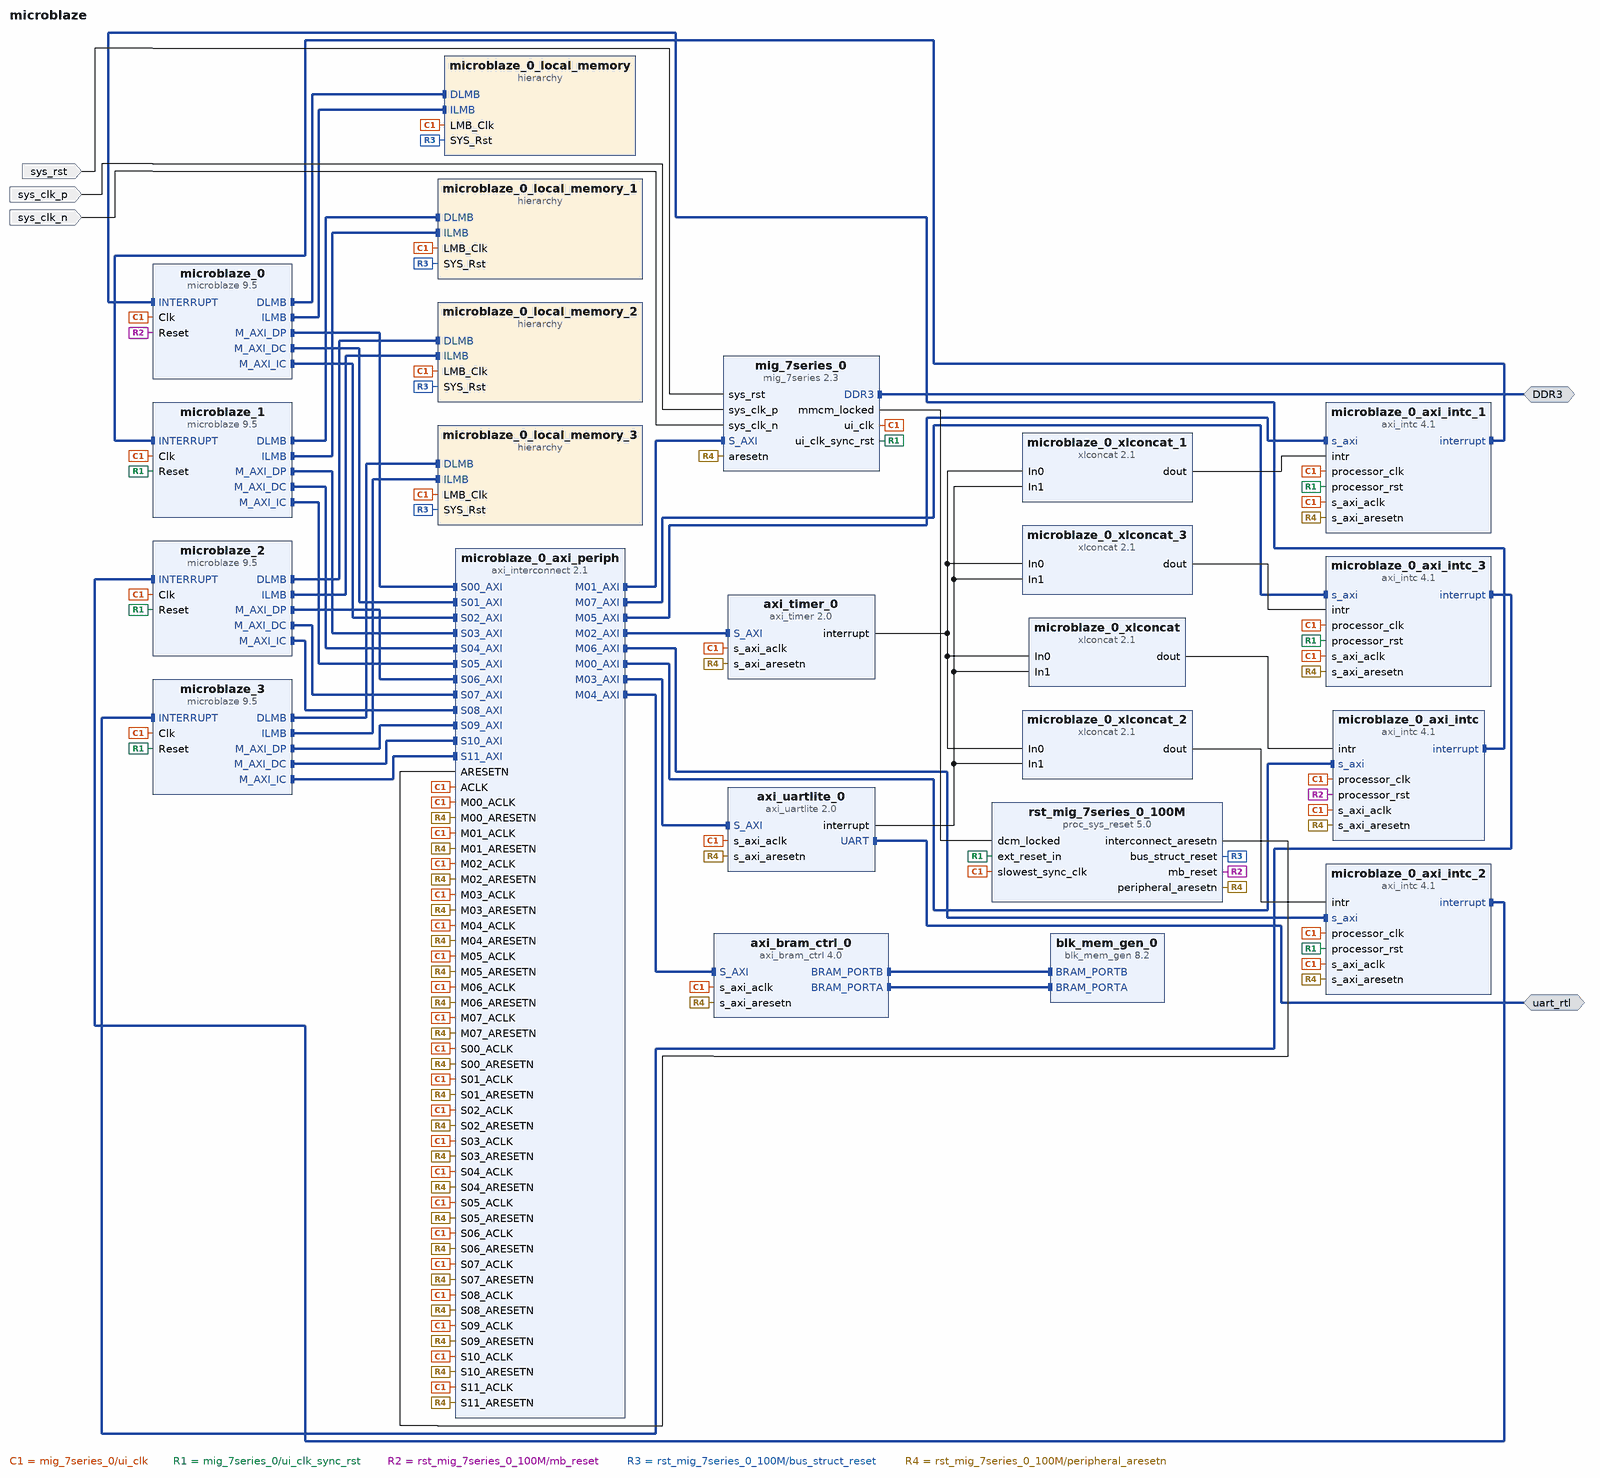
[diagram p0: block diagram of the top level]
# Vivado block design microblaze, Vivado 2015.1
create_bd_design microblaze

create_bd_intf_port -mode Master -vlnv xilinx.com:interface:uart_rtl:1.0 uart_rtl
create_bd_intf_port -mode Master -vlnv xilinx.com:interface:ddrx_rtl:1.0 DDR3
create_bd_port -dir I -type rst sys_rst
set_property -dict {CONFIG.POLARITY ACTIVE_HIGH} [get_bd_ports sys_rst]
create_bd_port -dir I -type clk sys_clk_p
set_property -dict {CONFIG.FREQ_HZ 200000000} [get_bd_ports sys_clk_p]
create_bd_port -dir I -type clk sys_clk_n
set_property -dict {CONFIG.FREQ_HZ 200000000} [get_bd_ports sys_clk_n]

create_bd_cell -type ip -vlnv xilinx.com:ip:mig_7series:2.3 mig_7series_0
set_property -dict [list \
  CONFIG.XML_INPUT_FILE mig_a.prj \
  CONFIG.RESET_BOARD_INTERFACE Custom \
  CONFIG.MIG_DONT_TOUCH_PARAM Custom \
  CONFIG.BOARD_MIG_PARAM Custom \
] [get_bd_cells mig_7series_0]
create_bd_cell -type ip -vlnv xilinx.com:ip:axi_interconnect:2.1 microblaze_0_axi_periph
set_property -dict {CONFIG.NUM_SI 12 CONFIG.NUM_MI 8} [get_bd_cells microblaze_0_axi_periph]
create_bd_cell -type ip -vlnv xilinx.com:ip:proc_sys_reset:5.0 rst_mig_7series_0_100M
create_bd_cell -type ip -vlnv xilinx.com:ip:axi_timer:2.0 axi_timer_0
create_bd_cell -type ip -vlnv xilinx.com:ip:axi_uartlite:2.0 axi_uartlite_0
create_bd_cell -type ip -vlnv xilinx.com:ip:blk_mem_gen:8.2 blk_mem_gen_0
set_property -dict [list \
  CONFIG.Memory_Type True_Dual_Port_RAM \
  CONFIG.Enable_B Use_ENB_Pin \
  CONFIG.Use_RSTB_Pin true \
  CONFIG.Port_B_Clock 100 \
  CONFIG.Port_B_Write_Rate 50 \
  CONFIG.Port_B_Enable_Rate 100 \
] [get_bd_cells blk_mem_gen_0]
create_bd_cell -type ip -vlnv xilinx.com:ip:axi_bram_ctrl:4.0 axi_bram_ctrl_0
create_bd_cell -type ip -vlnv xilinx.com:ip:axi_intc:4.1 microblaze_0_axi_intc
set_property -dict {CONFIG.C_HAS_FAST 1} [get_bd_cells microblaze_0_axi_intc]
create_bd_cell -type ip -vlnv xilinx.com:ip:microblaze:9.5 microblaze_0
set_property -dict [list \
  CONFIG.C_FAULT_TOLERANT 1 \
  CONFIG.C_D_AXI 1 \
  CONFIG.C_D_LMB 1 \
  CONFIG.C_I_LMB 1 \
  CONFIG.C_USE_BARREL 1 \
  CONFIG.C_USE_DIV 1 \
  CONFIG.C_DEBUG_ENABLED 0 \
  CONFIG.C_ICACHE_BASEADDR 0x80000000 \
  CONFIG.C_ICACHE_HIGHADDR 0xFFFFFFFF \
  CONFIG.C_USE_ICACHE 1 \
  CONFIG.C_CACHE_BYTE_SIZE 32768 \
  CONFIG.C_ICACHE_LINE_LEN 8 \
  CONFIG.C_ICACHE_ALWAYS_USED 1 \
  CONFIG.C_DCACHE_BASEADDR 0x80000000 \
  CONFIG.C_DCACHE_HIGHADDR 0xfFFFFFFF \
  CONFIG.C_USE_DCACHE 1 \
  CONFIG.C_DCACHE_BYTE_SIZE 32768 \
  CONFIG.C_DCACHE_LINE_LEN 8 \
  CONFIG.C_DCACHE_ALWAYS_USED 1 \
  CONFIG.C_USE_BRANCH_TARGET_CACHE 1 \
] [get_bd_cells microblaze_0]
create_bd_cell -type ip -vlnv xilinx.com:ip:xlconcat:2.1 microblaze_0_xlconcat
create_bd_cell -type hier microblaze_0_local_memory
create_bd_cell -type ip -vlnv xilinx.com:ip:axi_intc:4.1 microblaze_0_axi_intc_1
set_property -dict {CONFIG.C_HAS_FAST 1} [get_bd_cells microblaze_0_axi_intc_1]
create_bd_cell -type ip -vlnv xilinx.com:ip:microblaze:9.5 microblaze_1
set_property -dict [list \
  CONFIG.C_FAULT_TOLERANT 1 \
  CONFIG.C_D_AXI 1 \
  CONFIG.C_D_LMB 1 \
  CONFIG.C_I_LMB 1 \
  CONFIG.C_USE_BARREL 1 \
  CONFIG.C_USE_DIV 1 \
  CONFIG.C_DEBUG_ENABLED 0 \
  CONFIG.C_ICACHE_BASEADDR 0x80000000 \
  CONFIG.C_ICACHE_HIGHADDR 0xFFFFFFFF \
  CONFIG.C_USE_ICACHE 1 \
  CONFIG.C_CACHE_BYTE_SIZE 32768 \
  CONFIG.C_ICACHE_LINE_LEN 8 \
  CONFIG.C_ICACHE_ALWAYS_USED 1 \
  CONFIG.C_DCACHE_BASEADDR 0x80000000 \
  CONFIG.C_DCACHE_HIGHADDR 0xfFFFFFFF \
  CONFIG.C_USE_DCACHE 1 \
  CONFIG.C_DCACHE_BYTE_SIZE 32768 \
  CONFIG.C_DCACHE_LINE_LEN 8 \
  CONFIG.C_DCACHE_ALWAYS_USED 1 \
  CONFIG.C_USE_BRANCH_TARGET_CACHE 1 \
] [get_bd_cells microblaze_1]
create_bd_cell -type ip -vlnv xilinx.com:ip:xlconcat:2.1 microblaze_0_xlconcat_1
create_bd_cell -type hier microblaze_0_local_memory_1
create_bd_cell -type ip -vlnv xilinx.com:ip:axi_intc:4.1 microblaze_0_axi_intc_2
set_property -dict {CONFIG.C_HAS_FAST 1} [get_bd_cells microblaze_0_axi_intc_2]
create_bd_cell -type ip -vlnv xilinx.com:ip:microblaze:9.5 microblaze_2
set_property -dict [list \
  CONFIG.C_FAULT_TOLERANT 1 \
  CONFIG.C_D_AXI 1 \
  CONFIG.C_D_LMB 1 \
  CONFIG.C_I_LMB 1 \
  CONFIG.C_USE_BARREL 1 \
  CONFIG.C_USE_DIV 1 \
  CONFIG.C_DEBUG_ENABLED 0 \
  CONFIG.C_ICACHE_BASEADDR 0x80000000 \
  CONFIG.C_ICACHE_HIGHADDR 0xFFFFFFFF \
  CONFIG.C_USE_ICACHE 1 \
  CONFIG.C_CACHE_BYTE_SIZE 32768 \
  CONFIG.C_ICACHE_LINE_LEN 8 \
  CONFIG.C_ICACHE_ALWAYS_USED 1 \
  CONFIG.C_DCACHE_BASEADDR 0x80000000 \
  CONFIG.C_DCACHE_HIGHADDR 0xfFFFFFFF \
  CONFIG.C_USE_DCACHE 1 \
  CONFIG.C_DCACHE_BYTE_SIZE 32768 \
  CONFIG.C_DCACHE_LINE_LEN 8 \
  CONFIG.C_DCACHE_ALWAYS_USED 1 \
  CONFIG.C_USE_BRANCH_TARGET_CACHE 1 \
] [get_bd_cells microblaze_2]
create_bd_cell -type ip -vlnv xilinx.com:ip:xlconcat:2.1 microblaze_0_xlconcat_2
create_bd_cell -type hier microblaze_0_local_memory_2
create_bd_cell -type ip -vlnv xilinx.com:ip:axi_intc:4.1 microblaze_0_axi_intc_3
set_property -dict {CONFIG.C_HAS_FAST 1} [get_bd_cells microblaze_0_axi_intc_3]
create_bd_cell -type ip -vlnv xilinx.com:ip:microblaze:9.5 microblaze_3
set_property -dict [list \
  CONFIG.C_FAULT_TOLERANT 1 \
  CONFIG.C_D_AXI 1 \
  CONFIG.C_D_LMB 1 \
  CONFIG.C_I_LMB 1 \
  CONFIG.C_USE_BARREL 1 \
  CONFIG.C_USE_DIV 1 \
  CONFIG.C_DEBUG_ENABLED 0 \
  CONFIG.C_ICACHE_BASEADDR 0x80000000 \
  CONFIG.C_ICACHE_HIGHADDR 0xFFFFFFFF \
  CONFIG.C_USE_ICACHE 1 \
  CONFIG.C_CACHE_BYTE_SIZE 32768 \
  CONFIG.C_ICACHE_LINE_LEN 8 \
  CONFIG.C_ICACHE_ALWAYS_USED 1 \
  CONFIG.C_DCACHE_BASEADDR 0x80000000 \
  CONFIG.C_DCACHE_HIGHADDR 0xfFFFFFFF \
  CONFIG.C_USE_DCACHE 1 \
  CONFIG.C_DCACHE_BYTE_SIZE 32768 \
  CONFIG.C_DCACHE_LINE_LEN 8 \
  CONFIG.C_DCACHE_ALWAYS_USED 1 \
  CONFIG.C_USE_BRANCH_TARGET_CACHE 1 \
] [get_bd_cells microblaze_3]
create_bd_cell -type ip -vlnv xilinx.com:ip:xlconcat:2.1 microblaze_0_xlconcat_3
create_bd_cell -type hier microblaze_0_local_memory_3

# ---- hierarchy /microblaze_0_local_memory ----
current_bd_instance /microblaze_0_local_memory
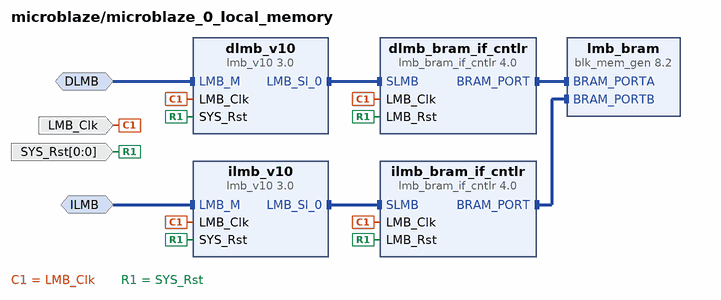
[diagram p1: block diagram inside /microblaze_0_local_memory]
create_bd_intf_pin -mode MirroredMaster -vlnv xilinx.com:interface:lmb_rtl:1.0 DLMB
create_bd_intf_pin -mode MirroredMaster -vlnv xilinx.com:interface:lmb_rtl:1.0 ILMB
create_bd_pin -dir I -type clk LMB_Clk
create_bd_pin -dir I -from 0 -to 0 -type rst SYS_Rst

create_bd_cell -type ip -vlnv xilinx.com:ip:lmb_v10:3.0 dlmb_v10
create_bd_cell -type ip -vlnv xilinx.com:ip:lmb_v10:3.0 ilmb_v10
create_bd_cell -type ip -vlnv xilinx.com:ip:lmb_bram_if_cntlr:4.0 dlmb_bram_if_cntlr
set_property -dict {CONFIG.C_ECC 0} [get_bd_cells dlmb_bram_if_cntlr]
create_bd_cell -type ip -vlnv xilinx.com:ip:lmb_bram_if_cntlr:4.0 ilmb_bram_if_cntlr
set_property -dict {CONFIG.C_ECC 0} [get_bd_cells ilmb_bram_if_cntlr]
create_bd_cell -type ip -vlnv xilinx.com:ip:blk_mem_gen:8.2 lmb_bram
set_property -dict {CONFIG.Memory_Type True_Dual_Port_RAM CONFIG.use_bram_block BRAM_Controller} [get_bd_cells lmb_bram]

# ---- hierarchy /microblaze_0_local_memory_1 ----
current_bd_instance /microblaze_0_local_memory_1
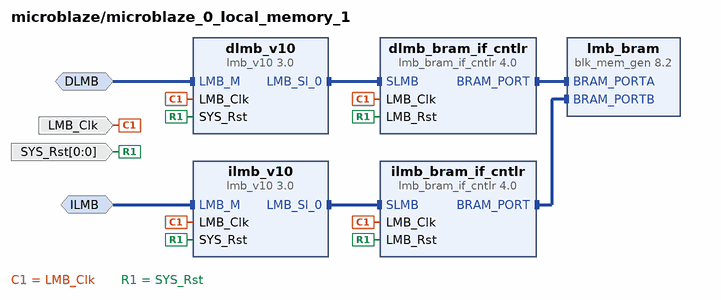
[diagram p2: block diagram inside /microblaze_0_local_memory_1]
create_bd_intf_pin -mode MirroredMaster -vlnv xilinx.com:interface:lmb_rtl:1.0 DLMB
create_bd_intf_pin -mode MirroredMaster -vlnv xilinx.com:interface:lmb_rtl:1.0 ILMB
create_bd_pin -dir I -type clk LMB_Clk
create_bd_pin -dir I -from 0 -to 0 -type rst SYS_Rst

create_bd_cell -type ip -vlnv xilinx.com:ip:lmb_v10:3.0 dlmb_v10
create_bd_cell -type ip -vlnv xilinx.com:ip:lmb_v10:3.0 ilmb_v10
create_bd_cell -type ip -vlnv xilinx.com:ip:lmb_bram_if_cntlr:4.0 dlmb_bram_if_cntlr
set_property -dict {CONFIG.C_ECC 0} [get_bd_cells dlmb_bram_if_cntlr]
create_bd_cell -type ip -vlnv xilinx.com:ip:lmb_bram_if_cntlr:4.0 ilmb_bram_if_cntlr
set_property -dict {CONFIG.C_ECC 0} [get_bd_cells ilmb_bram_if_cntlr]
create_bd_cell -type ip -vlnv xilinx.com:ip:blk_mem_gen:8.2 lmb_bram
set_property -dict {CONFIG.Memory_Type True_Dual_Port_RAM CONFIG.use_bram_block BRAM_Controller} [get_bd_cells lmb_bram]

# ---- hierarchy /microblaze_0_local_memory_2 ----
current_bd_instance /microblaze_0_local_memory_2
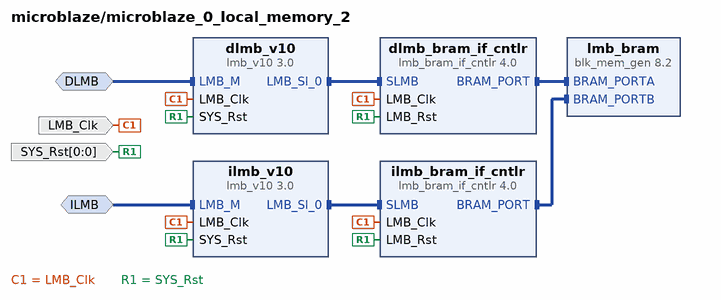
[diagram p3: block diagram inside /microblaze_0_local_memory_2]
create_bd_intf_pin -mode MirroredMaster -vlnv xilinx.com:interface:lmb_rtl:1.0 DLMB
create_bd_intf_pin -mode MirroredMaster -vlnv xilinx.com:interface:lmb_rtl:1.0 ILMB
create_bd_pin -dir I -type clk LMB_Clk
create_bd_pin -dir I -from 0 -to 0 -type rst SYS_Rst

create_bd_cell -type ip -vlnv xilinx.com:ip:lmb_v10:3.0 dlmb_v10
create_bd_cell -type ip -vlnv xilinx.com:ip:lmb_v10:3.0 ilmb_v10
create_bd_cell -type ip -vlnv xilinx.com:ip:lmb_bram_if_cntlr:4.0 dlmb_bram_if_cntlr
set_property -dict {CONFIG.C_ECC 0} [get_bd_cells dlmb_bram_if_cntlr]
create_bd_cell -type ip -vlnv xilinx.com:ip:lmb_bram_if_cntlr:4.0 ilmb_bram_if_cntlr
set_property -dict {CONFIG.C_ECC 0} [get_bd_cells ilmb_bram_if_cntlr]
create_bd_cell -type ip -vlnv xilinx.com:ip:blk_mem_gen:8.2 lmb_bram
set_property -dict {CONFIG.Memory_Type True_Dual_Port_RAM CONFIG.use_bram_block BRAM_Controller} [get_bd_cells lmb_bram]

# ---- hierarchy /microblaze_0_local_memory_3 ----
current_bd_instance /microblaze_0_local_memory_3
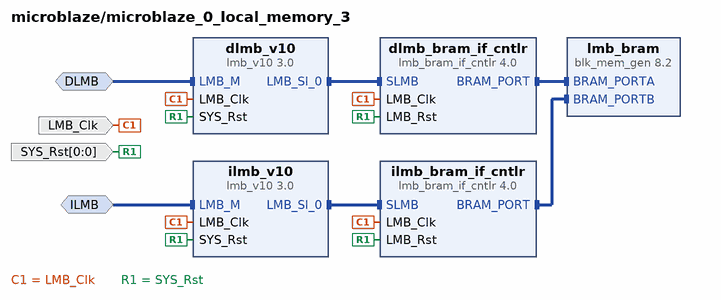
[diagram p4: block diagram inside /microblaze_0_local_memory_3]
create_bd_intf_pin -mode MirroredMaster -vlnv xilinx.com:interface:lmb_rtl:1.0 DLMB
create_bd_intf_pin -mode MirroredMaster -vlnv xilinx.com:interface:lmb_rtl:1.0 ILMB
create_bd_pin -dir I -type clk LMB_Clk
create_bd_pin -dir I -from 0 -to 0 -type rst SYS_Rst

create_bd_cell -type ip -vlnv xilinx.com:ip:lmb_v10:3.0 dlmb_v10
create_bd_cell -type ip -vlnv xilinx.com:ip:lmb_v10:3.0 ilmb_v10
create_bd_cell -type ip -vlnv xilinx.com:ip:lmb_bram_if_cntlr:4.0 dlmb_bram_if_cntlr
set_property -dict {CONFIG.C_ECC 0} [get_bd_cells dlmb_bram_if_cntlr]
create_bd_cell -type ip -vlnv xilinx.com:ip:lmb_bram_if_cntlr:4.0 ilmb_bram_if_cntlr
set_property -dict {CONFIG.C_ECC 0} [get_bd_cells ilmb_bram_if_cntlr]
create_bd_cell -type ip -vlnv xilinx.com:ip:blk_mem_gen:8.2 lmb_bram
set_property -dict {CONFIG.Memory_Type True_Dual_Port_RAM CONFIG.use_bram_block BRAM_Controller} [get_bd_cells lmb_bram]

# ---- connections ----

current_bd_instance /microblaze_0_local_memory
connect_bd_intf_net [get_bd_intf_pins dlmb_v10/LMB_Sl_0] [get_bd_intf_pins dlmb_bram_if_cntlr/SLMB]
connect_bd_intf_net [get_bd_intf_pins ilmb_v10/LMB_Sl_0] [get_bd_intf_pins ilmb_bram_if_cntlr/SLMB]
connect_bd_intf_net [get_bd_intf_pins dlmb_bram_if_cntlr/BRAM_PORT] [get_bd_intf_pins lmb_bram/BRAM_PORTA]
connect_bd_intf_net [get_bd_intf_pins ilmb_bram_if_cntlr/BRAM_PORT] [get_bd_intf_pins lmb_bram/BRAM_PORTB]
connect_bd_intf_net [get_bd_intf_pins DLMB] [get_bd_intf_pins dlmb_v10/LMB_M]
connect_bd_intf_net [get_bd_intf_pins ILMB] [get_bd_intf_pins ilmb_v10/LMB_M]
connect_bd_net -net microblaze_0_Clk [get_bd_pins LMB_Clk] \
  [get_bd_pins dlmb_v10/LMB_Clk] [get_bd_pins dlmb_bram_if_cntlr/LMB_Clk] [get_bd_pins ilmb_v10/LMB_Clk] \
  [get_bd_pins ilmb_bram_if_cntlr/LMB_Clk]
connect_bd_net [get_bd_pins SYS_Rst] \
  [get_bd_pins dlmb_v10/SYS_Rst] [get_bd_pins dlmb_bram_if_cntlr/LMB_Rst] [get_bd_pins ilmb_v10/SYS_Rst] \
  [get_bd_pins ilmb_bram_if_cntlr/LMB_Rst]

current_bd_instance /microblaze_0_local_memory_1
connect_bd_intf_net [get_bd_intf_pins dlmb_v10/LMB_Sl_0] [get_bd_intf_pins dlmb_bram_if_cntlr/SLMB]
connect_bd_intf_net [get_bd_intf_pins ilmb_v10/LMB_Sl_0] [get_bd_intf_pins ilmb_bram_if_cntlr/SLMB]
connect_bd_intf_net [get_bd_intf_pins dlmb_bram_if_cntlr/BRAM_PORT] [get_bd_intf_pins lmb_bram/BRAM_PORTA]
connect_bd_intf_net [get_bd_intf_pins ilmb_bram_if_cntlr/BRAM_PORT] [get_bd_intf_pins lmb_bram/BRAM_PORTB]
connect_bd_intf_net [get_bd_intf_pins DLMB] [get_bd_intf_pins dlmb_v10/LMB_M]
connect_bd_intf_net [get_bd_intf_pins ILMB] [get_bd_intf_pins ilmb_v10/LMB_M]
connect_bd_net -net microblaze_0_Clk [get_bd_pins LMB_Clk] \
  [get_bd_pins dlmb_v10/LMB_Clk] [get_bd_pins dlmb_bram_if_cntlr/LMB_Clk] [get_bd_pins ilmb_v10/LMB_Clk] \
  [get_bd_pins ilmb_bram_if_cntlr/LMB_Clk]
connect_bd_net [get_bd_pins SYS_Rst] \
  [get_bd_pins dlmb_v10/SYS_Rst] [get_bd_pins dlmb_bram_if_cntlr/LMB_Rst] [get_bd_pins ilmb_v10/SYS_Rst] \
  [get_bd_pins ilmb_bram_if_cntlr/LMB_Rst]

current_bd_instance /microblaze_0_local_memory_2
connect_bd_intf_net [get_bd_intf_pins dlmb_v10/LMB_Sl_0] [get_bd_intf_pins dlmb_bram_if_cntlr/SLMB]
connect_bd_intf_net [get_bd_intf_pins ilmb_v10/LMB_Sl_0] [get_bd_intf_pins ilmb_bram_if_cntlr/SLMB]
connect_bd_intf_net [get_bd_intf_pins dlmb_bram_if_cntlr/BRAM_PORT] [get_bd_intf_pins lmb_bram/BRAM_PORTA]
connect_bd_intf_net [get_bd_intf_pins ilmb_bram_if_cntlr/BRAM_PORT] [get_bd_intf_pins lmb_bram/BRAM_PORTB]
connect_bd_intf_net [get_bd_intf_pins DLMB] [get_bd_intf_pins dlmb_v10/LMB_M]
connect_bd_intf_net [get_bd_intf_pins ILMB] [get_bd_intf_pins ilmb_v10/LMB_M]
connect_bd_net -net microblaze_0_Clk [get_bd_pins LMB_Clk] \
  [get_bd_pins dlmb_v10/LMB_Clk] [get_bd_pins dlmb_bram_if_cntlr/LMB_Clk] [get_bd_pins ilmb_v10/LMB_Clk] \
  [get_bd_pins ilmb_bram_if_cntlr/LMB_Clk]
connect_bd_net [get_bd_pins SYS_Rst] \
  [get_bd_pins dlmb_v10/SYS_Rst] [get_bd_pins dlmb_bram_if_cntlr/LMB_Rst] [get_bd_pins ilmb_v10/SYS_Rst] \
  [get_bd_pins ilmb_bram_if_cntlr/LMB_Rst]

current_bd_instance /microblaze_0_local_memory_3
connect_bd_intf_net [get_bd_intf_pins dlmb_v10/LMB_Sl_0] [get_bd_intf_pins dlmb_bram_if_cntlr/SLMB]
connect_bd_intf_net [get_bd_intf_pins ilmb_v10/LMB_Sl_0] [get_bd_intf_pins ilmb_bram_if_cntlr/SLMB]
connect_bd_intf_net [get_bd_intf_pins dlmb_bram_if_cntlr/BRAM_PORT] [get_bd_intf_pins lmb_bram/BRAM_PORTA]
connect_bd_intf_net [get_bd_intf_pins ilmb_bram_if_cntlr/BRAM_PORT] [get_bd_intf_pins lmb_bram/BRAM_PORTB]
connect_bd_intf_net [get_bd_intf_pins DLMB] [get_bd_intf_pins dlmb_v10/LMB_M]
connect_bd_intf_net [get_bd_intf_pins ILMB] [get_bd_intf_pins ilmb_v10/LMB_M]
connect_bd_net -net microblaze_0_Clk [get_bd_pins LMB_Clk] \
  [get_bd_pins dlmb_v10/LMB_Clk] [get_bd_pins dlmb_bram_if_cntlr/LMB_Clk] [get_bd_pins ilmb_v10/LMB_Clk] \
  [get_bd_pins ilmb_bram_if_cntlr/LMB_Clk]
connect_bd_net [get_bd_pins SYS_Rst] \
  [get_bd_pins dlmb_v10/SYS_Rst] [get_bd_pins dlmb_bram_if_cntlr/LMB_Rst] [get_bd_pins ilmb_v10/SYS_Rst] \
  [get_bd_pins ilmb_bram_if_cntlr/LMB_Rst]

current_bd_instance /
connect_bd_intf_net [get_bd_intf_pins microblaze_0_axi_periph/S00_AXI] [get_bd_intf_pins microblaze_0/M_AXI_DP]
connect_bd_intf_net [get_bd_intf_pins microblaze_0_axi_periph/M00_AXI] [get_bd_intf_pins microblaze_0_axi_intc/s_axi]
connect_bd_intf_net [get_bd_intf_pins microblaze_0/M_AXI_DC] [get_bd_intf_pins microblaze_0_axi_periph/S01_AXI]
connect_bd_intf_net [get_bd_intf_pins microblaze_0/M_AXI_IC] [get_bd_intf_pins microblaze_0_axi_periph/S02_AXI]
connect_bd_intf_net [get_bd_intf_pins microblaze_0_axi_periph/M01_AXI] [get_bd_intf_pins mig_7series_0/S_AXI]
connect_bd_intf_net [get_bd_intf_pins microblaze_0_axi_periph/M02_AXI] [get_bd_intf_pins axi_timer_0/S_AXI]
connect_bd_intf_net [get_bd_intf_pins microblaze_0_axi_periph/M03_AXI] [get_bd_intf_pins axi_uartlite_0/S_AXI]
connect_bd_intf_net [get_bd_intf_pins blk_mem_gen_0/BRAM_PORTB] [get_bd_intf_pins axi_bram_ctrl_0/BRAM_PORTB]
connect_bd_intf_net [get_bd_intf_pins blk_mem_gen_0/BRAM_PORTA] [get_bd_intf_pins axi_bram_ctrl_0/BRAM_PORTA]
connect_bd_intf_net [get_bd_intf_pins microblaze_0_axi_periph/M04_AXI] [get_bd_intf_pins axi_bram_ctrl_0/S_AXI]
connect_bd_intf_net [get_bd_intf_pins microblaze_0_axi_periph/M05_AXI] [get_bd_intf_pins microblaze_0_axi_intc_1/s_axi]
connect_bd_intf_net [get_bd_intf_pins microblaze_1/M_AXI_DP] [get_bd_intf_pins microblaze_0_axi_periph/S03_AXI]
connect_bd_intf_net [get_bd_intf_pins microblaze_1/M_AXI_DC] [get_bd_intf_pins microblaze_0_axi_periph/S04_AXI]
connect_bd_intf_net [get_bd_intf_pins microblaze_1/M_AXI_IC] [get_bd_intf_pins microblaze_0_axi_periph/S05_AXI]
connect_bd_intf_net [get_bd_intf_pins microblaze_0_axi_periph/M06_AXI] [get_bd_intf_pins microblaze_0_axi_intc_2/s_axi]
connect_bd_intf_net [get_bd_intf_pins microblaze_2/M_AXI_DP] [get_bd_intf_pins microblaze_0_axi_periph/S06_AXI]
connect_bd_intf_net [get_bd_intf_pins microblaze_2/M_AXI_DC] [get_bd_intf_pins microblaze_0_axi_periph/S07_AXI]
connect_bd_intf_net [get_bd_intf_pins microblaze_2/M_AXI_IC] [get_bd_intf_pins microblaze_0_axi_periph/S08_AXI]
connect_bd_intf_net [get_bd_intf_pins microblaze_0_axi_periph/M07_AXI] [get_bd_intf_pins microblaze_0_axi_intc_3/s_axi]
connect_bd_intf_net [get_bd_intf_pins microblaze_3/M_AXI_DP] [get_bd_intf_pins microblaze_0_axi_periph/S09_AXI]
connect_bd_intf_net [get_bd_intf_pins microblaze_3/M_AXI_DC] [get_bd_intf_pins microblaze_0_axi_periph/S10_AXI]
connect_bd_intf_net [get_bd_intf_pins microblaze_3/M_AXI_IC] [get_bd_intf_pins microblaze_0_axi_periph/S11_AXI]
connect_bd_intf_net [get_bd_intf_pins microblaze_0_axi_intc/interrupt] [get_bd_intf_pins microblaze_0/INTERRUPT]
connect_bd_intf_net [get_bd_intf_pins microblaze_0/DLMB] [get_bd_intf_pins microblaze_0_local_memory/DLMB]
connect_bd_intf_net [get_bd_intf_pins microblaze_0/ILMB] [get_bd_intf_pins microblaze_0_local_memory/ILMB]
connect_bd_intf_net [get_bd_intf_pins microblaze_0_axi_intc_1/interrupt] [get_bd_intf_pins microblaze_1/INTERRUPT]
connect_bd_intf_net [get_bd_intf_pins microblaze_1/DLMB] [get_bd_intf_pins microblaze_0_local_memory_1/DLMB]
connect_bd_intf_net [get_bd_intf_pins microblaze_1/ILMB] [get_bd_intf_pins microblaze_0_local_memory_1/ILMB]
connect_bd_intf_net [get_bd_intf_pins microblaze_0_axi_intc_2/interrupt] [get_bd_intf_pins microblaze_2/INTERRUPT]
connect_bd_intf_net [get_bd_intf_pins microblaze_2/DLMB] [get_bd_intf_pins microblaze_0_local_memory_2/DLMB]
connect_bd_intf_net [get_bd_intf_pins microblaze_2/ILMB] [get_bd_intf_pins microblaze_0_local_memory_2/ILMB]
connect_bd_intf_net [get_bd_intf_pins microblaze_0_axi_intc_3/interrupt] [get_bd_intf_pins microblaze_3/INTERRUPT]
connect_bd_intf_net [get_bd_intf_pins microblaze_3/DLMB] [get_bd_intf_pins microblaze_0_local_memory_3/DLMB]
connect_bd_intf_net [get_bd_intf_pins microblaze_3/ILMB] [get_bd_intf_pins microblaze_0_local_memory_3/ILMB]
connect_bd_intf_net [get_bd_intf_ports uart_rtl] [get_bd_intf_pins axi_uartlite_0/UART]
connect_bd_intf_net [get_bd_intf_ports DDR3] [get_bd_intf_pins mig_7series_0/DDR3]
connect_bd_net -net microblaze_0_Clk [get_bd_pins mig_7series_0/ui_clk] \
  [get_bd_pins microblaze_0_axi_periph/ACLK] [get_bd_pins microblaze_0_axi_periph/S00_ACLK] \
  [get_bd_pins microblaze_0_axi_periph/M00_ACLK] [get_bd_pins rst_mig_7series_0_100M/slowest_sync_clk] \
  [get_bd_pins microblaze_0_axi_periph/S01_ACLK] [get_bd_pins microblaze_0_axi_periph/S02_ACLK] \
  [get_bd_pins microblaze_0_axi_periph/M01_ACLK] [get_bd_pins axi_timer_0/s_axi_aclk] \
  [get_bd_pins microblaze_0_axi_periph/M02_ACLK] [get_bd_pins axi_uartlite_0/s_axi_aclk] \
  [get_bd_pins microblaze_0_axi_periph/M03_ACLK] [get_bd_pins axi_bram_ctrl_0/s_axi_aclk] \
  [get_bd_pins microblaze_0_axi_periph/M04_ACLK] [get_bd_pins microblaze_0_axi_periph/M05_ACLK] \
  [get_bd_pins microblaze_0_axi_periph/S03_ACLK] [get_bd_pins microblaze_0_axi_periph/S04_ACLK] \
  [get_bd_pins microblaze_0_axi_periph/S05_ACLK] [get_bd_pins microblaze_0_axi_periph/M06_ACLK] \
  [get_bd_pins microblaze_0_axi_periph/S06_ACLK] [get_bd_pins microblaze_0_axi_periph/S07_ACLK] \
  [get_bd_pins microblaze_0_axi_periph/S08_ACLK] [get_bd_pins microblaze_0_axi_periph/M07_ACLK] \
  [get_bd_pins microblaze_0_axi_periph/S09_ACLK] [get_bd_pins microblaze_0_axi_periph/S10_ACLK] \
  [get_bd_pins microblaze_0_axi_periph/S11_ACLK] [get_bd_pins microblaze_0/Clk] \
  [get_bd_pins microblaze_0_axi_intc/processor_clk] [get_bd_pins microblaze_0_local_memory/LMB_Clk] \
  [get_bd_pins microblaze_0_axi_intc/s_axi_aclk] [get_bd_pins microblaze_1/Clk] \
  [get_bd_pins microblaze_0_axi_intc_1/processor_clk] [get_bd_pins microblaze_0_local_memory_1/LMB_Clk] \
  [get_bd_pins microblaze_0_axi_intc_1/s_axi_aclk] [get_bd_pins microblaze_2/Clk] \
  [get_bd_pins microblaze_0_axi_intc_2/processor_clk] [get_bd_pins microblaze_0_local_memory_2/LMB_Clk] \
  [get_bd_pins microblaze_0_axi_intc_2/s_axi_aclk] [get_bd_pins microblaze_3/Clk] \
  [get_bd_pins microblaze_0_axi_intc_3/processor_clk] [get_bd_pins microblaze_0_local_memory_3/LMB_Clk] \
  [get_bd_pins microblaze_0_axi_intc_3/s_axi_aclk]
connect_bd_net [get_bd_pins mig_7series_0/mmcm_locked] [get_bd_pins rst_mig_7series_0_100M/dcm_locked]
connect_bd_net [get_bd_pins mig_7series_0/ui_clk_sync_rst] \
  [get_bd_pins rst_mig_7series_0_100M/ext_reset_in] [get_bd_pins microblaze_1/Reset] \
  [get_bd_pins microblaze_0_axi_intc_1/processor_rst] [get_bd_pins microblaze_2/Reset] \
  [get_bd_pins microblaze_0_axi_intc_2/processor_rst] [get_bd_pins microblaze_3/Reset] \
  [get_bd_pins microblaze_0_axi_intc_3/processor_rst]
connect_bd_net [get_bd_pins rst_mig_7series_0_100M/mb_reset] [get_bd_pins microblaze_0/Reset] [get_bd_pins microblaze_0_axi_intc/processor_rst]
connect_bd_net [get_bd_pins rst_mig_7series_0_100M/bus_struct_reset] \
  [get_bd_pins microblaze_0_local_memory/SYS_Rst] [get_bd_pins microblaze_0_local_memory_1/SYS_Rst] \
  [get_bd_pins microblaze_0_local_memory_2/SYS_Rst] [get_bd_pins microblaze_0_local_memory_3/SYS_Rst]
connect_bd_net [get_bd_pins rst_mig_7series_0_100M/interconnect_aresetn] [get_bd_pins microblaze_0_axi_periph/ARESETN]
connect_bd_net [get_bd_pins rst_mig_7series_0_100M/peripheral_aresetn] \
  [get_bd_pins microblaze_0_axi_periph/S00_ARESETN] [get_bd_pins microblaze_0_axi_periph/M00_ARESETN] \
  [get_bd_pins microblaze_0_axi_periph/S01_ARESETN] [get_bd_pins microblaze_0_axi_periph/S02_ARESETN] \
  [get_bd_pins mig_7series_0/aresetn] [get_bd_pins microblaze_0_axi_periph/M01_ARESETN] \
  [get_bd_pins axi_timer_0/s_axi_aresetn] [get_bd_pins microblaze_0_axi_periph/M02_ARESETN] \
  [get_bd_pins axi_uartlite_0/s_axi_aresetn] [get_bd_pins microblaze_0_axi_periph/M03_ARESETN] \
  [get_bd_pins axi_bram_ctrl_0/s_axi_aresetn] [get_bd_pins microblaze_0_axi_periph/M04_ARESETN] \
  [get_bd_pins microblaze_0_axi_periph/M05_ARESETN] [get_bd_pins microblaze_0_axi_periph/S03_ARESETN] \
  [get_bd_pins microblaze_0_axi_periph/S04_ARESETN] [get_bd_pins microblaze_0_axi_periph/S05_ARESETN] \
  [get_bd_pins microblaze_0_axi_periph/M06_ARESETN] [get_bd_pins microblaze_0_axi_periph/S06_ARESETN] \
  [get_bd_pins microblaze_0_axi_periph/S07_ARESETN] [get_bd_pins microblaze_0_axi_periph/S08_ARESETN] \
  [get_bd_pins microblaze_0_axi_periph/M07_ARESETN] [get_bd_pins microblaze_0_axi_periph/S09_ARESETN] \
  [get_bd_pins microblaze_0_axi_periph/S10_ARESETN] [get_bd_pins microblaze_0_axi_periph/S11_ARESETN] \
  [get_bd_pins microblaze_0_axi_intc/s_axi_aresetn] [get_bd_pins microblaze_0_axi_intc_1/s_axi_aresetn] \
  [get_bd_pins microblaze_0_axi_intc_2/s_axi_aresetn] [get_bd_pins microblaze_0_axi_intc_3/s_axi_aresetn]
connect_bd_net [get_bd_pins axi_timer_0/interrupt] \
  [get_bd_pins microblaze_0_xlconcat/In0] [get_bd_pins microblaze_0_xlconcat_1/In0] [get_bd_pins microblaze_0_xlconcat_2/In0] \
  [get_bd_pins microblaze_0_xlconcat_3/In0]
connect_bd_net [get_bd_pins axi_uartlite_0/interrupt] \
  [get_bd_pins microblaze_0_xlconcat/In1] [get_bd_pins microblaze_0_xlconcat_1/In1] [get_bd_pins microblaze_0_xlconcat_2/In1] \
  [get_bd_pins microblaze_0_xlconcat_3/In1]
connect_bd_net [get_bd_ports sys_rst] [get_bd_pins mig_7series_0/sys_rst]
connect_bd_net [get_bd_ports sys_clk_p] [get_bd_pins mig_7series_0/sys_clk_p]
connect_bd_net [get_bd_ports sys_clk_n] [get_bd_pins mig_7series_0/sys_clk_n]
connect_bd_net -net microblaze_0_intr [get_bd_pins microblaze_0_xlconcat/dout] [get_bd_pins microblaze_0_axi_intc/intr]
connect_bd_net -net microblaze_0_intr_1 [get_bd_pins microblaze_0_xlconcat_1/dout] [get_bd_pins microblaze_0_axi_intc_1/intr]
connect_bd_net -net microblaze_0_intr_2 [get_bd_pins microblaze_0_xlconcat_2/dout] [get_bd_pins microblaze_0_axi_intc_2/intr]
connect_bd_net -net microblaze_0_intr_3 [get_bd_pins microblaze_0_xlconcat_3/dout] [get_bd_pins microblaze_0_axi_intc_3/intr]

# ---- address map ----
assign_bd_address -offset 0x00000000 -range 64K -target_address_space [get_bd_addr_spaces microblaze_0/Data] [get_bd_addr_segs microblaze_0_local_memory/dlmb_bram_if_cntlr/SLMB/Mem]
assign_bd_address -offset 0x40600000 -range 64K -target_address_space [get_bd_addr_spaces microblaze_0/Data] [get_bd_addr_segs axi_uartlite_0/S_AXI/Reg]
assign_bd_address -offset 0x41200000 -range 64K -target_address_space [get_bd_addr_spaces microblaze_0/Data] [get_bd_addr_segs microblaze_0_axi_intc/s_axi/Reg]
assign_bd_address -offset 0x41210000 -range 64K -target_address_space [get_bd_addr_spaces microblaze_0/Data] [get_bd_addr_segs microblaze_0_axi_intc_1/s_axi/Reg]
assign_bd_address -offset 0x41220000 -range 64K -target_address_space [get_bd_addr_spaces microblaze_0/Data] [get_bd_addr_segs microblaze_0_axi_intc_2/s_axi/Reg]
assign_bd_address -offset 0x41230000 -range 64K -target_address_space [get_bd_addr_spaces microblaze_0/Data] [get_bd_addr_segs microblaze_0_axi_intc_3/s_axi/Reg]
assign_bd_address -offset 0x41C00000 -range 64K -target_address_space [get_bd_addr_spaces microblaze_0/Data] [get_bd_addr_segs axi_timer_0/S_AXI/Reg]
assign_bd_address -offset 0x80000000 -range 1G -target_address_space [get_bd_addr_spaces microblaze_0/Data] [get_bd_addr_segs mig_7series_0/memmap/memaddr]
assign_bd_address -offset 0xC0000000 -range 8K -target_address_space [get_bd_addr_spaces microblaze_0/Data] [get_bd_addr_segs axi_bram_ctrl_0/S_AXI/Mem0]
assign_bd_address -offset 0x00000000 -range 64K -target_address_space [get_bd_addr_spaces microblaze_0/Instruction] [get_bd_addr_segs microblaze_0_local_memory/ilmb_bram_if_cntlr/SLMB/Mem]
assign_bd_address -offset 0x40600000 -range 64K -target_address_space [get_bd_addr_spaces microblaze_0/Instruction] [get_bd_addr_segs axi_uartlite_0/S_AXI/Reg]
assign_bd_address -offset 0x41200000 -range 64K -target_address_space [get_bd_addr_spaces microblaze_0/Instruction] [get_bd_addr_segs microblaze_0_axi_intc/s_axi/Reg]
assign_bd_address -offset 0x41210000 -range 64K -target_address_space [get_bd_addr_spaces microblaze_0/Instruction] [get_bd_addr_segs microblaze_0_axi_intc_1/s_axi/Reg]
assign_bd_address -offset 0x41220000 -range 64K -target_address_space [get_bd_addr_spaces microblaze_0/Instruction] [get_bd_addr_segs microblaze_0_axi_intc_2/s_axi/Reg]
assign_bd_address -offset 0x41230000 -range 64K -target_address_space [get_bd_addr_spaces microblaze_0/Instruction] [get_bd_addr_segs microblaze_0_axi_intc_3/s_axi/Reg]
assign_bd_address -offset 0x41C00000 -range 64K -target_address_space [get_bd_addr_spaces microblaze_0/Instruction] [get_bd_addr_segs axi_timer_0/S_AXI/Reg]
assign_bd_address -offset 0x80000000 -range 1G -target_address_space [get_bd_addr_spaces microblaze_0/Instruction] [get_bd_addr_segs mig_7series_0/memmap/memaddr]
assign_bd_address -offset 0xC0000000 -range 8K -target_address_space [get_bd_addr_spaces microblaze_0/Instruction] [get_bd_addr_segs axi_bram_ctrl_0/S_AXI/Mem0]
assign_bd_address -offset 0x00000000 -range 8K -target_address_space [get_bd_addr_spaces microblaze_1/Data] [get_bd_addr_segs microblaze_0_local_memory_1/dlmb_bram_if_cntlr/SLMB/Mem]
assign_bd_address -offset 0x40600000 -range 64K -target_address_space [get_bd_addr_spaces microblaze_1/Data] [get_bd_addr_segs axi_uartlite_0/S_AXI/Reg]
assign_bd_address -offset 0x41200000 -range 64K -target_address_space [get_bd_addr_spaces microblaze_1/Data] [get_bd_addr_segs microblaze_0_axi_intc/s_axi/Reg]
assign_bd_address -offset 0x41210000 -range 64K -target_address_space [get_bd_addr_spaces microblaze_1/Data] [get_bd_addr_segs microblaze_0_axi_intc_1/s_axi/Reg]
assign_bd_address -offset 0x41220000 -range 64K -target_address_space [get_bd_addr_spaces microblaze_1/Data] [get_bd_addr_segs microblaze_0_axi_intc_2/s_axi/Reg]
assign_bd_address -offset 0x41230000 -range 64K -target_address_space [get_bd_addr_spaces microblaze_1/Data] [get_bd_addr_segs microblaze_0_axi_intc_3/s_axi/Reg]
assign_bd_address -offset 0x41C00000 -range 64K -target_address_space [get_bd_addr_spaces microblaze_1/Data] [get_bd_addr_segs axi_timer_0/S_AXI/Reg]
assign_bd_address -offset 0x80000000 -range 1G -target_address_space [get_bd_addr_spaces microblaze_1/Data] [get_bd_addr_segs mig_7series_0/memmap/memaddr]
assign_bd_address -offset 0xC0000000 -range 8K -target_address_space [get_bd_addr_spaces microblaze_1/Data] [get_bd_addr_segs axi_bram_ctrl_0/S_AXI/Mem0]
assign_bd_address -offset 0x00000000 -range 8K -target_address_space [get_bd_addr_spaces microblaze_1/Instruction] [get_bd_addr_segs microblaze_0_local_memory_1/ilmb_bram_if_cntlr/SLMB/Mem]
assign_bd_address -offset 0x40600000 -range 64K -target_address_space [get_bd_addr_spaces microblaze_1/Instruction] [get_bd_addr_segs axi_uartlite_0/S_AXI/Reg]
assign_bd_address -offset 0x41200000 -range 64K -target_address_space [get_bd_addr_spaces microblaze_1/Instruction] [get_bd_addr_segs microblaze_0_axi_intc/s_axi/Reg]
assign_bd_address -offset 0x41210000 -range 64K -target_address_space [get_bd_addr_spaces microblaze_1/Instruction] [get_bd_addr_segs microblaze_0_axi_intc_1/s_axi/Reg]
assign_bd_address -offset 0x41220000 -range 64K -target_address_space [get_bd_addr_spaces microblaze_1/Instruction] [get_bd_addr_segs microblaze_0_axi_intc_2/s_axi/Reg]
assign_bd_address -offset 0x41230000 -range 64K -target_address_space [get_bd_addr_spaces microblaze_1/Instruction] [get_bd_addr_segs microblaze_0_axi_intc_3/s_axi/Reg]
assign_bd_address -offset 0x41C00000 -range 64K -target_address_space [get_bd_addr_spaces microblaze_1/Instruction] [get_bd_addr_segs axi_timer_0/S_AXI/Reg]
assign_bd_address -offset 0x80000000 -range 1G -target_address_space [get_bd_addr_spaces microblaze_1/Instruction] [get_bd_addr_segs mig_7series_0/memmap/memaddr]
assign_bd_address -offset 0xC0000000 -range 8K -target_address_space [get_bd_addr_spaces microblaze_1/Instruction] [get_bd_addr_segs axi_bram_ctrl_0/S_AXI/Mem0]
assign_bd_address -offset 0x00000000 -range 8K -target_address_space [get_bd_addr_spaces microblaze_2/Data] [get_bd_addr_segs microblaze_0_local_memory_2/dlmb_bram_if_cntlr/SLMB/Mem]
assign_bd_address -offset 0x40600000 -range 64K -target_address_space [get_bd_addr_spaces microblaze_2/Data] [get_bd_addr_segs axi_uartlite_0/S_AXI/Reg]
assign_bd_address -offset 0x41200000 -range 64K -target_address_space [get_bd_addr_spaces microblaze_2/Data] [get_bd_addr_segs microblaze_0_axi_intc/s_axi/Reg]
assign_bd_address -offset 0x41210000 -range 64K -target_address_space [get_bd_addr_spaces microblaze_2/Data] [get_bd_addr_segs microblaze_0_axi_intc_1/s_axi/Reg]
assign_bd_address -offset 0x41220000 -range 64K -target_address_space [get_bd_addr_spaces microblaze_2/Data] [get_bd_addr_segs microblaze_0_axi_intc_2/s_axi/Reg]
assign_bd_address -offset 0x41230000 -range 64K -target_address_space [get_bd_addr_spaces microblaze_2/Data] [get_bd_addr_segs microblaze_0_axi_intc_3/s_axi/Reg]
assign_bd_address -offset 0x41C00000 -range 64K -target_address_space [get_bd_addr_spaces microblaze_2/Data] [get_bd_addr_segs axi_timer_0/S_AXI/Reg]
assign_bd_address -offset 0x80000000 -range 1G -target_address_space [get_bd_addr_spaces microblaze_2/Data] [get_bd_addr_segs mig_7series_0/memmap/memaddr]
assign_bd_address -offset 0xC0000000 -range 8K -target_address_space [get_bd_addr_spaces microblaze_2/Data] [get_bd_addr_segs axi_bram_ctrl_0/S_AXI/Mem0]
assign_bd_address -offset 0x00000000 -range 8K -target_address_space [get_bd_addr_spaces microblaze_2/Instruction] [get_bd_addr_segs microblaze_0_local_memory_2/ilmb_bram_if_cntlr/SLMB/Mem]
assign_bd_address -offset 0x40600000 -range 64K -target_address_space [get_bd_addr_spaces microblaze_2/Instruction] [get_bd_addr_segs axi_uartlite_0/S_AXI/Reg]
assign_bd_address -offset 0x41200000 -range 64K -target_address_space [get_bd_addr_spaces microblaze_2/Instruction] [get_bd_addr_segs microblaze_0_axi_intc/s_axi/Reg]
assign_bd_address -offset 0x41210000 -range 64K -target_address_space [get_bd_addr_spaces microblaze_2/Instruction] [get_bd_addr_segs microblaze_0_axi_intc_1/s_axi/Reg]
assign_bd_address -offset 0x41220000 -range 64K -target_address_space [get_bd_addr_spaces microblaze_2/Instruction] [get_bd_addr_segs microblaze_0_axi_intc_2/s_axi/Reg]
assign_bd_address -offset 0x41230000 -range 64K -target_address_space [get_bd_addr_spaces microblaze_2/Instruction] [get_bd_addr_segs microblaze_0_axi_intc_3/s_axi/Reg]
assign_bd_address -offset 0x41C00000 -range 64K -target_address_space [get_bd_addr_spaces microblaze_2/Instruction] [get_bd_addr_segs axi_timer_0/S_AXI/Reg]
assign_bd_address -offset 0x80000000 -range 1G -target_address_space [get_bd_addr_spaces microblaze_2/Instruction] [get_bd_addr_segs mig_7series_0/memmap/memaddr]
assign_bd_address -offset 0xC0000000 -range 8K -target_address_space [get_bd_addr_spaces microblaze_2/Instruction] [get_bd_addr_segs axi_bram_ctrl_0/S_AXI/Mem0]
assign_bd_address -offset 0x00000000 -range 8K -target_address_space [get_bd_addr_spaces microblaze_3/Data] [get_bd_addr_segs microblaze_0_local_memory_3/dlmb_bram_if_cntlr/SLMB/Mem]
assign_bd_address -offset 0x40600000 -range 64K -target_address_space [get_bd_addr_spaces microblaze_3/Data] [get_bd_addr_segs axi_uartlite_0/S_AXI/Reg]
assign_bd_address -offset 0x41200000 -range 64K -target_address_space [get_bd_addr_spaces microblaze_3/Data] [get_bd_addr_segs microblaze_0_axi_intc/s_axi/Reg]
assign_bd_address -offset 0x41210000 -range 64K -target_address_space [get_bd_addr_spaces microblaze_3/Data] [get_bd_addr_segs microblaze_0_axi_intc_1/s_axi/Reg]
assign_bd_address -offset 0x41220000 -range 64K -target_address_space [get_bd_addr_spaces microblaze_3/Data] [get_bd_addr_segs microblaze_0_axi_intc_2/s_axi/Reg]
assign_bd_address -offset 0x41230000 -range 64K -target_address_space [get_bd_addr_spaces microblaze_3/Data] [get_bd_addr_segs microblaze_0_axi_intc_3/s_axi/Reg]
assign_bd_address -offset 0x41C00000 -range 64K -target_address_space [get_bd_addr_spaces microblaze_3/Data] [get_bd_addr_segs axi_timer_0/S_AXI/Reg]
assign_bd_address -offset 0x80000000 -range 1G -target_address_space [get_bd_addr_spaces microblaze_3/Data] [get_bd_addr_segs mig_7series_0/memmap/memaddr]
assign_bd_address -offset 0xC0000000 -range 8K -target_address_space [get_bd_addr_spaces microblaze_3/Data] [get_bd_addr_segs axi_bram_ctrl_0/S_AXI/Mem0]
assign_bd_address -offset 0x00000000 -range 8K -target_address_space [get_bd_addr_spaces microblaze_3/Instruction] [get_bd_addr_segs microblaze_0_local_memory_3/ilmb_bram_if_cntlr/SLMB/Mem]
assign_bd_address -offset 0x40600000 -range 64K -target_address_space [get_bd_addr_spaces microblaze_3/Instruction] [get_bd_addr_segs axi_uartlite_0/S_AXI/Reg]
assign_bd_address -offset 0x41200000 -range 64K -target_address_space [get_bd_addr_spaces microblaze_3/Instruction] [get_bd_addr_segs microblaze_0_axi_intc/s_axi/Reg]
assign_bd_address -offset 0x41210000 -range 64K -target_address_space [get_bd_addr_spaces microblaze_3/Instruction] [get_bd_addr_segs microblaze_0_axi_intc_1/s_axi/Reg]
assign_bd_address -offset 0x41220000 -range 64K -target_address_space [get_bd_addr_spaces microblaze_3/Instruction] [get_bd_addr_segs microblaze_0_axi_intc_2/s_axi/Reg]
assign_bd_address -offset 0x41230000 -range 64K -target_address_space [get_bd_addr_spaces microblaze_3/Instruction] [get_bd_addr_segs microblaze_0_axi_intc_3/s_axi/Reg]
assign_bd_address -offset 0x41C00000 -range 64K -target_address_space [get_bd_addr_spaces microblaze_3/Instruction] [get_bd_addr_segs axi_timer_0/S_AXI/Reg]
assign_bd_address -offset 0x80000000 -range 1G -target_address_space [get_bd_addr_spaces microblaze_3/Instruction] [get_bd_addr_segs mig_7series_0/memmap/memaddr]
assign_bd_address -offset 0xC0000000 -range 8K -target_address_space [get_bd_addr_spaces microblaze_3/Instruction] [get_bd_addr_segs axi_bram_ctrl_0/S_AXI/Mem0]

validate_bd_design
save_bd_design
